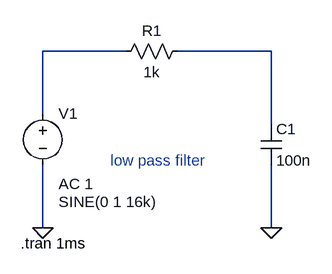
[diagram p0: schematic LowPassFilter Transient.asc]
LowPassFilter Transient.asc, the LTspice schematic file:
Version 4
SHEET 1 880 680
WIRE 112 32 -16 32
WIRE 336 32 192 32
WIRE -16 128 -16 32
WIRE 336 144 336 32
WIRE -16 304 -16 208
WIRE 336 304 336 208
FLAG -16 304 0
FLAG 336 304 0
SYMBOL voltage -16 112 R0
WINDOW 3 24 152 Left 2
WINDOW 123 24 124 Left 2
WINDOW 39 0 0 Left 0
SYMATTR InstName V1
SYMATTR Value SINE(0 1 16k)
SYMATTR Value2 AC 1
SYMBOL res 208 16 R90
WINDOW 0 0 56 VBottom 2
WINDOW 3 32 56 VTop 2
SYMATTR InstName R1
SYMATTR Value 1k
SYMBOL cap 320 144 R0
SYMATTR InstName C1
SYMATTR Value 100n
TEXT 88 200 Left 2 ;low pass filter
TEXT -50 328 Left 2 !.tran 1ms

The netlist it stands for:
* LowPassFilter Transient.asc
V1 N001 0 SINE(0 1 16k) AC 1
R1 N002 N001 1k
C1 N002 0 100n
* low pass filter
.tran 1ms
.backanno
.end